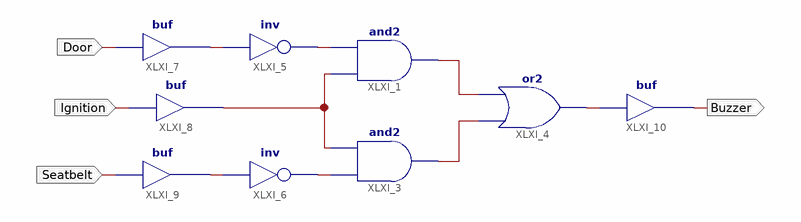
[diagram p0: schematic sheet 1]
// Xilinx ISE schematic AutoLogic.sch (spartan3) as structural Verilog: 9 symbols, 4 ports
module AutoLogic (
  input  Door,
  input  Ignition,
  input  Seatbelt,
  output Buzzer
);

  wire XLXN_1, XLXN_2, XLXN_3, XLXN_5, XLXN_6, XLXN_7, XLXN_8, XLXN_9;

  and XLXI_1 (XLXN_5, XLXN_3, XLXN_1);
  and XLXI_3 (XLXN_6, XLXN_2, XLXN_3);
  or XLXI_4 (XLXN_9, XLXN_6, XLXN_5);
  not XLXI_5 (XLXN_1, XLXN_7);
  not XLXI_6 (XLXN_2, XLXN_8);
  buf XLXI_7 (XLXN_7, Door);
  buf XLXI_8 (XLXN_3, Ignition);
  buf XLXI_9 (XLXN_8, Seatbelt);
  buf XLXI_10 (Buzzer, XLXN_9);

  // Notes on the sheet:
  //   LOC on signal Door = E11
  //   LOC on signal Ignition = K2
  //   LOC on signal Seatbelt = A13
  //   LOC on signal Buzzer = M6
endmodule
